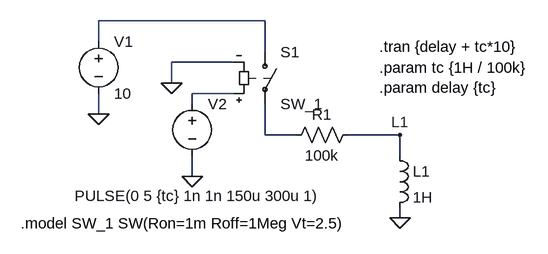
[diagram p0: schematic inductor-theory-sw.asc]
inductor-theory-sw.asc, the LTspice schematic file:
Version 4
SHEET 1 1076 680
WIRE 464 80 208 80
WIRE 208 112 208 80
WIRE 464 128 464 80
WIRE 416 144 320 144
WIRE 320 176 320 144
WIRE 416 192 352 192
WIRE 352 208 352 192
WIRE 208 224 208 192
WIRE 464 256 464 208
WIRE 512 256 464 256
WIRE 672 256 592 256
WIRE 672 288 672 256
WIRE 352 320 352 288
WIRE 672 384 672 368
FLAG 672 384 0
FLAG 208 224 0
FLAG 352 320 0
FLAG 320 176 0
FLAG 672 256 L1
SYMBOL ind 656 272 R0
SYMATTR InstName L1
SYMATTR Value 1H
SYMBOL sw 464 112 R0
SYMATTR InstName S1
SYMATTR Value SW_1
SYMBOL voltage 208 96 R0
SYMATTR InstName V1
SYMATTR Value 10
SYMBOL voltage 352 192 R0
WINDOW 3 -181 158 Left 2
SYMATTR Value PULSE(0 5 {tc} 1n 1n 150u 300u 1)
SYMATTR InstName V2
SYMBOL Res 608 240 R90
WINDOW 0 0 56 VBottom 2
WINDOW 3 32 56 VTop 2
SYMATTR InstName R1
SYMATTR Value 100k
TEXT 88 392 Left 2 !.model SW_1 SW(Ron=1m Roff=1Meg Vt=2.5)
TEXT 640 120 Left 2 !.tran {delay + tc*10}
TEXT 640 152 Left 2 !.param tc {1H / 100k}\n.param delay {tc}

The netlist it stands for:
* inductor-theory-sw.asc
L1 L1 0 1H
S1 N001 N003 N002 0 SW_1
V1 N001 0 10
V2 N002 0 PULSE(0 5 {tc} 1n 1n 150u 300u 1)
R1 L1 N003 100k
.model SW_1 SW(Ron=1m Roff=1Meg Vt=2.5)
.tran {delay + tc*10}
.param tc {1H / 100k}
.param delay {tc}
.backanno
.end